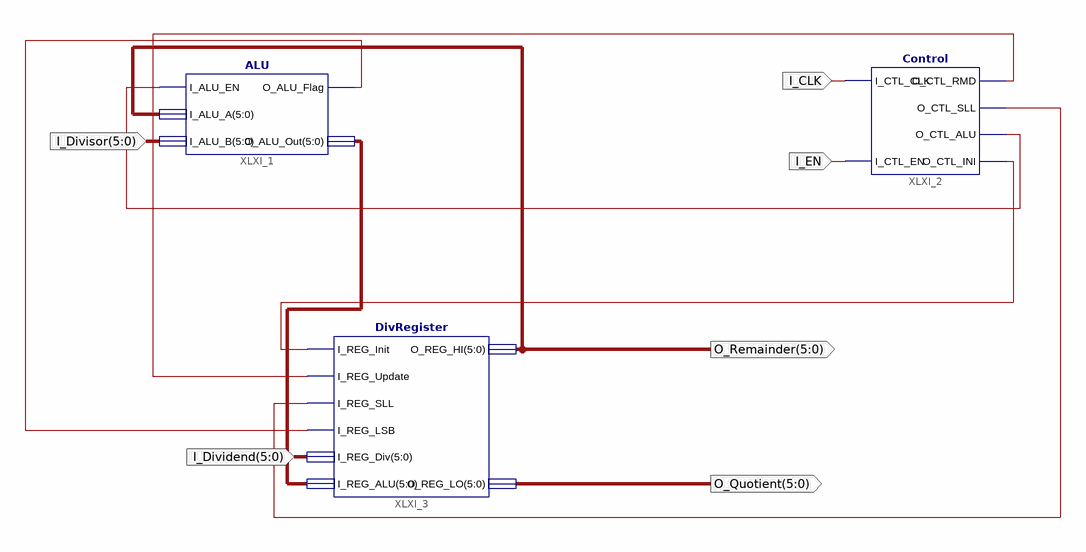
[diagram p0: schematic sheet 1]
// Xilinx ISE schematic Division.sch (artix7) as structural Verilog: 3 symbols, 6 ports
module Division (
  input  I_CLK,
  input  I_EN,
  input  [5:0] I_Divisor,
  input  [5:0] I_Dividend,
  output [5:0] O_Remainder,
  output [5:0] O_Quotient
);

  wire XLXN_1, XLXN_2, XLXN_3, XLXN_4, XLXN_5;
  wire [5:0] XLXN_8;

  ALU XLXI_1 (.I_ALU_EN(XLXN_4), .I_ALU_A(O_Remainder), .I_ALU_B(I_Divisor), .O_ALU_Flag(XLXN_5), .O_ALU_Out(XLXN_8));
  Control XLXI_2 (
    .I_CTL_CLK(I_CLK), .I_CTL_EN(I_EN), .O_CTL_RMD(XLXN_3), .O_CTL_SLL(XLXN_1), .O_CTL_ALU(XLXN_4),
    .O_CTL_INI(XLXN_2));
  DivRegister XLXI_3 (
    .I_REG_Init(XLXN_2), .I_REG_Update(XLXN_3), .I_REG_SLL(XLXN_1), .I_REG_LSB(XLXN_5),
    .I_REG_Div(I_Dividend), .I_REG_ALU(XLXN_8), .O_REG_HI(O_Remainder), .O_REG_LO(O_Quotient));
endmodule
